# EAGLE schematic 702_universal_3pin (EAGLE 7.4.0)
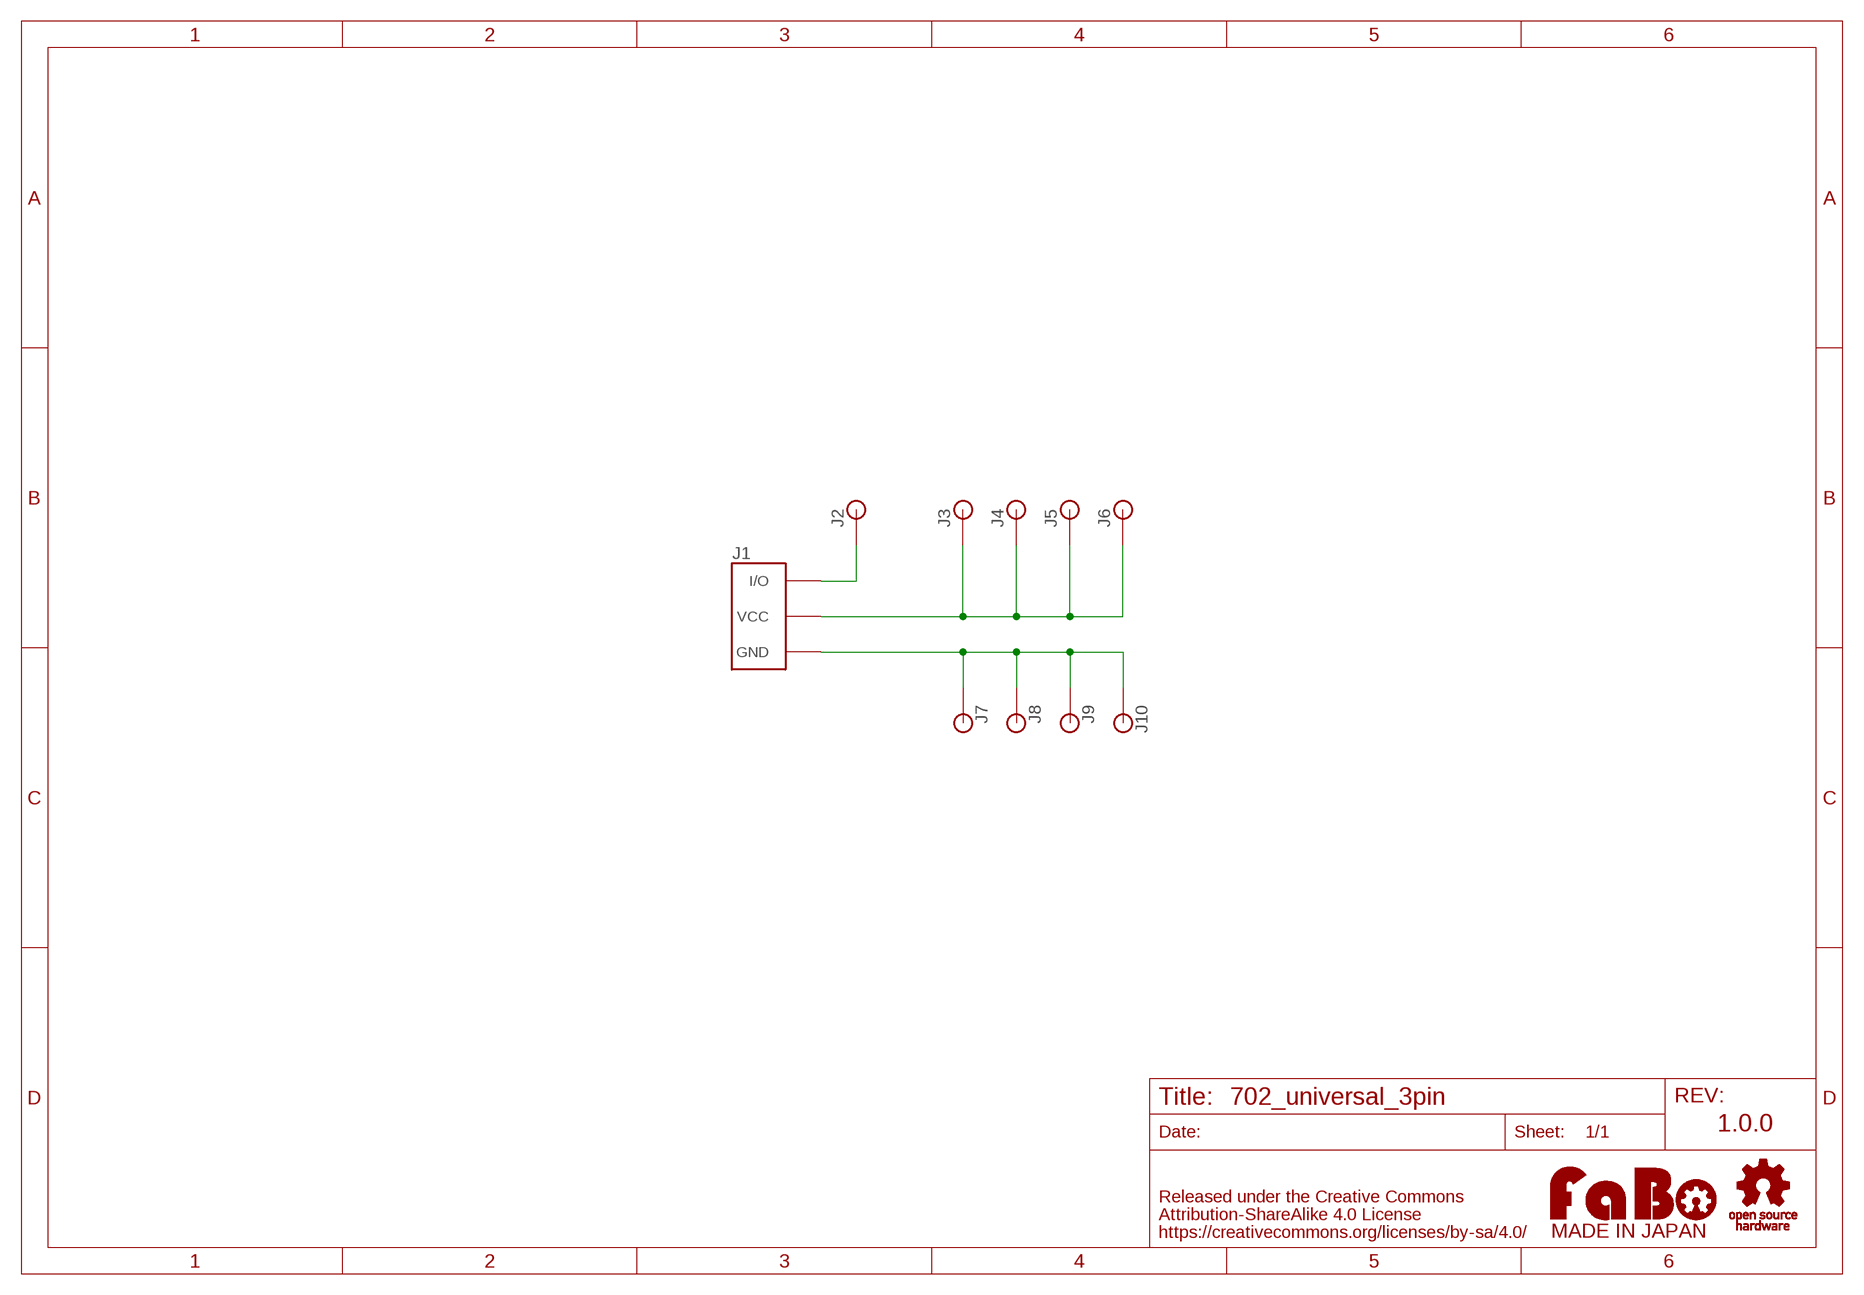
[diagram p0: schematic, sheet 1]

## Parts
J1  FABO_BRICK_3PIN-UNIVERSAL  [FABO_BRICK_3PIN_UNIVERSAL]
J2  PINHEAD_1X1-NONAME  [PIN_1X1_NONAME]
J3  PINHEAD_1X1-NONAME  [PIN_1X1_NONAME]
J4  PINHEAD_1X1-NONAME  [PIN_1X1_NONAME]
J5  PINHEAD_1X1-NONAME  [PIN_1X1_NONAME]
J6  PINHEAD_1X1-NONAME  [PIN_1X1_NONAME]
J7  PINHEAD_1X1-NONAME  [PIN_1X1_NONAME]
J8  PINHEAD_1X1-NONAME  [PIN_1X1_NONAME]
J9  PINHEAD_1X1-NONAME  [PIN_1X1_NONAME]
J10  PINHEAD_1X1-NONAME  [PIN_1X1_NONAME]
U$1  LOGO_OSHW-S_BOTTOM  [LOGO_OSHW_S_BOTTOM]
U$3  LOGO_FABO-M_BOTTOM  [LOGO_FABO_M_BOTTOM]

## Nets
GND: J1.GND J7.1 J8.1 J9.1 J10.1
IO: J1.IN/OUT(I/O) J2.1
VCC: J1.VCC J3.1 J4.1 J5.1 J6.1

## Notes on the sheet
- 1.0.0

## Library data of the parts
J1 = FaBo-Template:FABO_BRICK_3PIN: FaBo Brick 3pin
J2-J10 = FaBo-etc:PINHEAD_1X1
U$1 = FaBo-etc:LOGO_OSHW
U$3 = FaBo-etc:LOGO_FABO